# EAGLE schematic testscreen_4x4 (EAGLE 9.3.0)
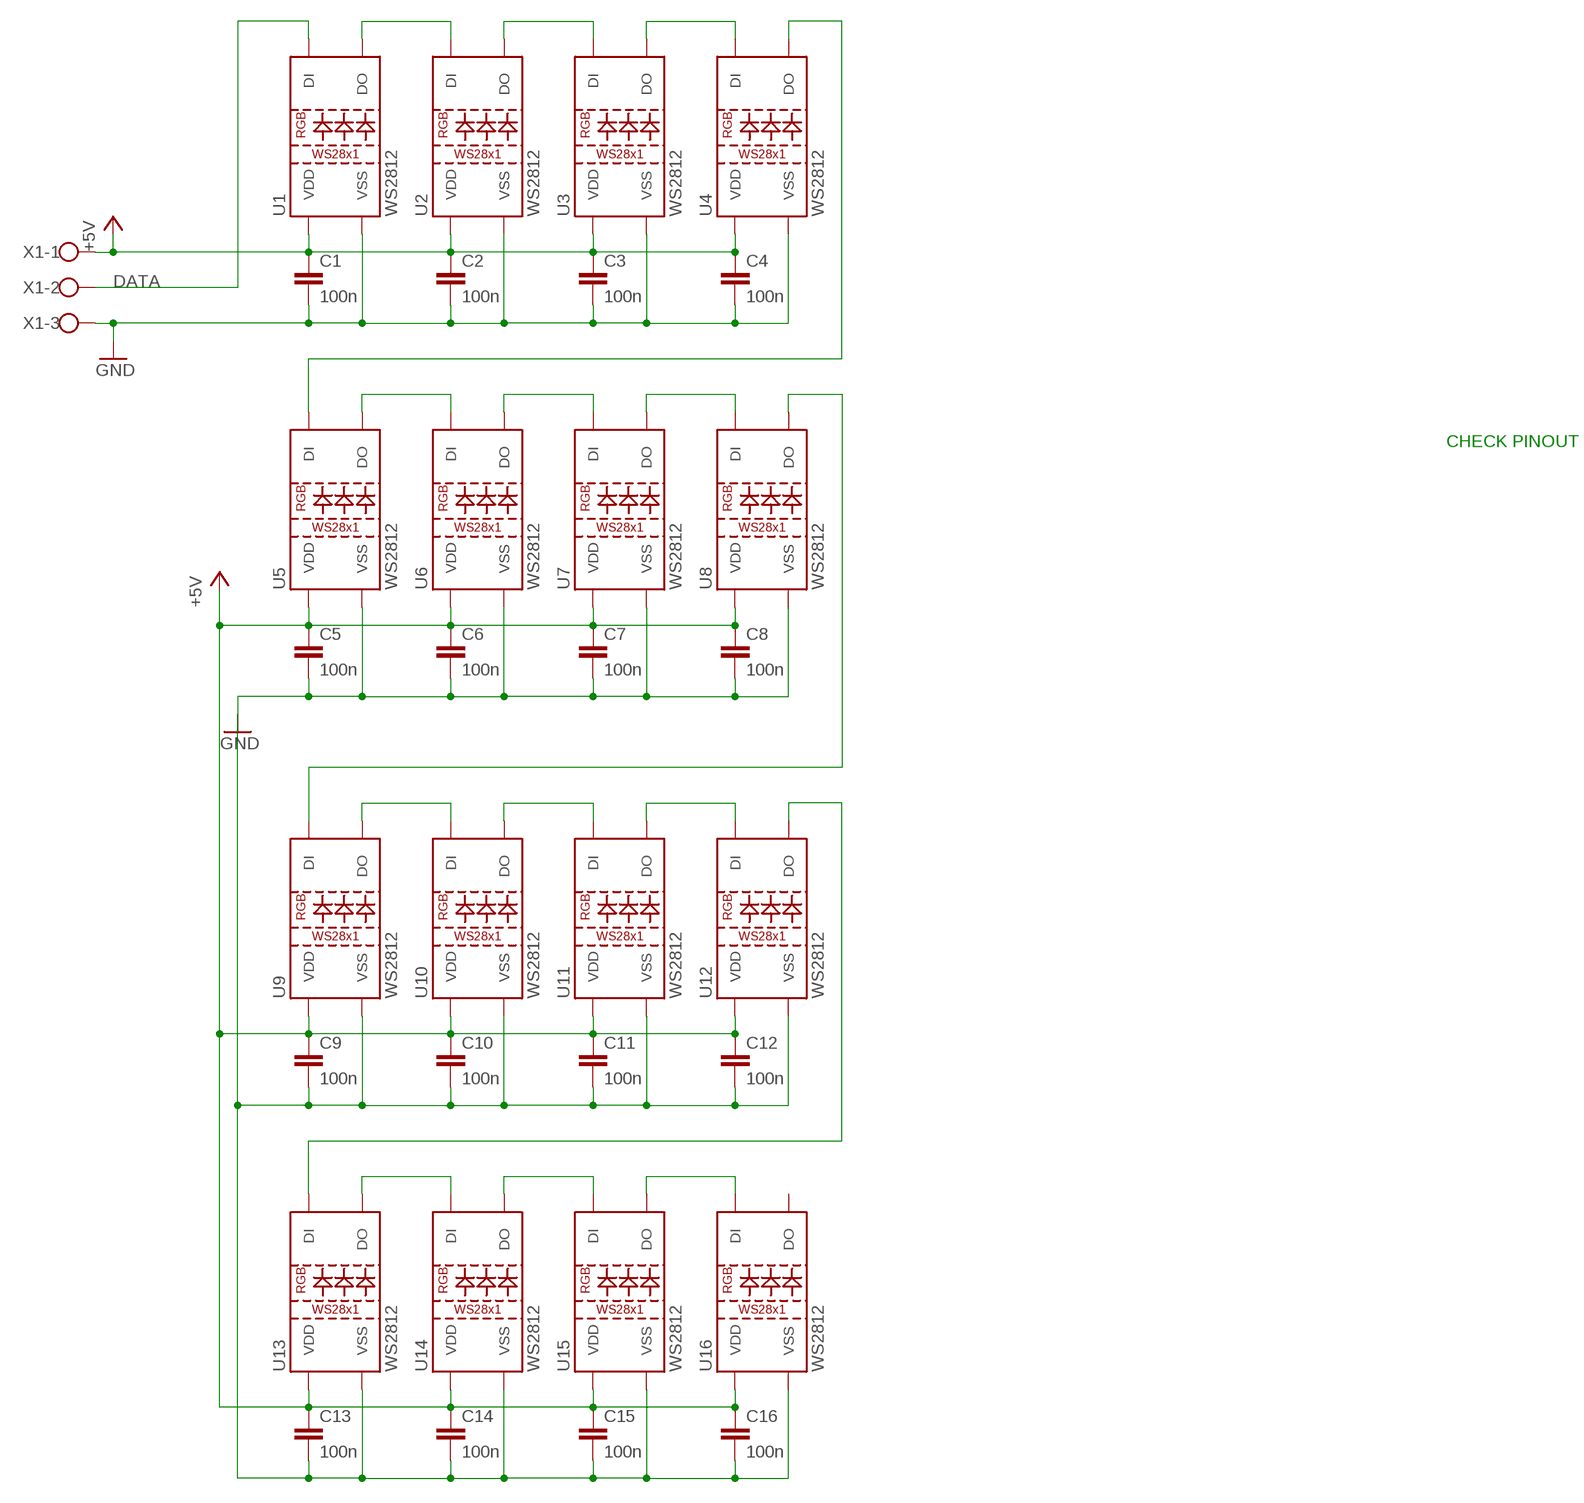
[diagram p0: schematic, sheet 1]

## Parts
C1  100n  C-EUC0805  [C0805]
C2  100n  C-EUC0805  [C0805]
C3  100n  C-EUC0805  [C0805]
C4  100n  C-EUC0805  [C0805]
C5  100n  C-EUC0805  [C0805]
C6  100n  C-EUC0805  [C0805]
C7  100n  C-EUC0805  [C0805]
C8  100n  C-EUC0805  [C0805]
C9  100n  C-EUC0805  [C0805]
C10  100n  C-EUC0805  [C0805]
C11  100n  C-EUC0805  [C0805]
C12  100n  C-EUC0805  [C0805]
C13  100n  C-EUC0805  [C0805]
C14  100n  C-EUC0805  [C0805]
C15  100n  C-EUC0805  [C0805]
C16  100n  C-EUC0805  [C0805]
U1  WS2812  WS2812"  [LED-TRICOLOR-5050-IC]
U2  WS2812  WS2812"  [LED-TRICOLOR-5050-IC]
U3  WS2812  WS2812"  [LED-TRICOLOR-5050-IC]
U4  WS2812  WS2812"  [LED-TRICOLOR-5050-IC]
U5  WS2812  WS2812"  [LED-TRICOLOR-5050-IC]
U6  WS2812  WS2812"  [LED-TRICOLOR-5050-IC]
U7  WS2812  WS2812"  [LED-TRICOLOR-5050-IC]
U8  WS2812  WS2812"  [LED-TRICOLOR-5050-IC]
U9  WS2812  WS2812"  [LED-TRICOLOR-5050-IC]
U10  WS2812  WS2812"  [LED-TRICOLOR-5050-IC]
U11  WS2812  WS2812"  [LED-TRICOLOR-5050-IC]
U12  WS2812  WS2812"  [LED-TRICOLOR-5050-IC]
U13  WS2812  WS2812"  [LED-TRICOLOR-5050-IC]
U14  WS2812  WS2812"  [LED-TRICOLOR-5050-IC]
U15  WS2812  WS2812"  [LED-TRICOLOR-5050-IC]
U16  WS2812  WS2812"  [LED-TRICOLOR-5050-IC]
X1  W237-103  [W237-103]

## Nets
+5V: C1.1 C2.1 C3.1 C4.1 C5.1 C6.1 C7.1 C8.1 C9.1 C10.1 C11.1 C12.1 C13.1 C14.1 C15.1 C16.1 U1.3(VDD) U1.5(VDD) U2.3(VDD) U2.5(VDD) U3.3(VDD) U3.5(VDD) U4.3(VDD) U4.5(VDD) U5.3(VDD) U5.5(VDD) U6.3(VDD) U6.5(VDD) U7.3(VDD) U7.5(VDD) U8.3(VDD) U8.5(VDD) U9.3(VDD) U9.5(VDD) U10.3(VDD) U10.5(VDD) U11.3(VDD) U11.5(VDD) U12.3(VDD) U12.5(VDD) U13.3(VDD) U13.5(VDD) U14.3(VDD) U14.5(VDD) U15.3(VDD) U15.5(VDD) U16.3(VDD) U16.5(VDD) X1.1
DATA: U1.2(DI) X1.2
DATA1: U4.1(DO) U5.2(DI)
DATA3: U12.1(DO) U13.2(DI)
GND: C1.2 C2.2 C3.2 C4.2 C5.2 C6.2 C7.2 C8.2 C9.2 C10.2 C11.2 C12.2 C13.2 C14.2 C15.2 C16.2 U1.6(VSS) U2.6(VSS) U3.6(VSS) U4.6(VSS) U5.6(VSS) U6.6(VSS) U7.6(VSS) U8.6(VSS) U9.6(VSS) U10.6(VSS) U11.6(VSS) U12.6(VSS) U13.6(VSS) U14.6(VSS) U15.6(VSS) U16.6(VSS) X1.3
N$1: U1.1(DO) U2.2(DI)
N$2: U2.1(DO) U3.2(DI)
N$3: U3.1(DO) U4.2(DI)
N$4: U9.1(DO) U10.2(DI)
N$5: U5.1(DO) U6.2(DI)
N$6: U6.1(DO) U7.2(DI)
N$7: U7.1(DO) U8.2(DI)
N$8: U10.1(DO) U11.2(DI)
N$9: U11.1(DO) U12.2(DI)
N$10: U13.1(DO) U14.2(DI)
N$11: U14.1(DO) U15.2(DI)
N$12: U15.1(DO) U16.2(DI)
N$13: U8.1(DO) U9.2(DI)
Unconnected: U16.1(DO)

## Notes on the sheet
- CHECK PINOUT

## Library data of the parts
C1-C16 = resistor:C-EU: CAPACITOR, European symbol
U1-U16 = SparkFun-LED:WS2812: WS2812 RGB LED w/ WS2811 driver 5x5mm SMD LED with built-in controller IC. Color: Red/Green/Blue mC Rating: RGB: 550, 1100, 200 mcd Current:RGB: 20, 20, 20 mA Forward Voltage: RGB: 1.8, 3.0, 3.2 V Packages:LED-TRICOLOR-5050-IC SparkFun Products: LED-SMD RGB (WS2812) <https://www.sparkfun.com/products/11821>; PROD_ID: DIO-11598
X1 = con-wago-500:W237-103: WAGO SCREW CLAMP; MPN: 237-103; OC_FARNELL: unknown; OC_NEWARK: 18M7116